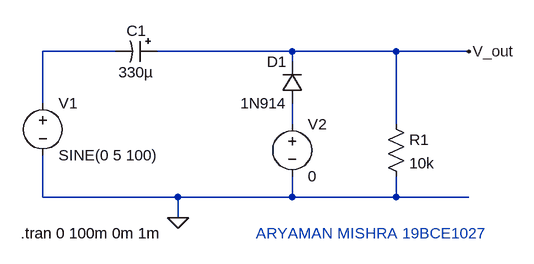
[diagram p0: schematic Draft5 (1).asc]
Draft5 (1).asc, the LTspice schematic file:
Version 4
SHEET 1 880 680
WIRE 160 32 48 32
WIRE 432 32 224 32
WIRE 592 32 432 32
WIRE 704 32 592 32
WIRE 432 48 432 32
WIRE 48 112 48 32
WIRE 432 144 432 112
WIRE 592 144 592 32
WIRE 48 256 48 192
WIRE 256 256 48 256
WIRE 432 256 432 224
WIRE 432 256 256 256
WIRE 592 256 592 224
WIRE 592 256 432 256
WIRE 704 256 592 256
WIRE 256 288 256 256
FLAG 256 288 0
FLAG 704 32 V_out
SYMBOL voltage 48 96 R0
WINDOW 123 0 0 Left 0
WINDOW 39 0 0 Left 0
SYMATTR InstName V1
SYMATTR Value SINE(0 5 100)
SYMBOL polcap 224 16 R90
WINDOW 0 0 32 VBottom 2
WINDOW 3 32 32 VTop 2
SYMATTR InstName C1
SYMATTR Value 330µ
SYMATTR Description Capacitor
SYMATTR Type cap
SYMATTR SpiceLine V=50 Irms=1.2 Rser=0.08 Lser=0 mfg="Panasonic" pn="ECA1HFQ331" type="Al electrolytic"
SYMBOL res 576 128 R0
SYMATTR InstName R1
SYMATTR Value 10k
SYMBOL voltage 432 128 R0
WINDOW 123 0 0 Left 0
WINDOW 39 0 0 Left 0
SYMATTR InstName V2
SYMATTR Value 0
SYMBOL diode 448 112 R180
WINDOW 0 24 64 Left 2
WINDOW 3 24 0 Left 2
SYMATTR InstName D1
SYMATTR Value 1N914
TEXT 14 312 Left 2 !.tran 0 100m 0m 1m
TEXT 376 312 Left 2 ;ARYAMAN MISHRA 19BCE1027

The netlist it stands for:
* Draft5 (1).asc
V1 N001 0 SINE(0 5 100)
C1 V_out N001 330µ V=50 Irms=1.2 Rser=0.08 Lser=0 mfg="Panasonic" pn="ECA1HFQ331" type="Al electrolytic"
R1 V_out 0 10k
V2 N002 0 0
D1 N002 V_out 1N914
.model D D
.lib standard.dio
.tran 0 100m 0m 1m
* ARYAMAN MISHRA 19BCE1027
.backanno
.end